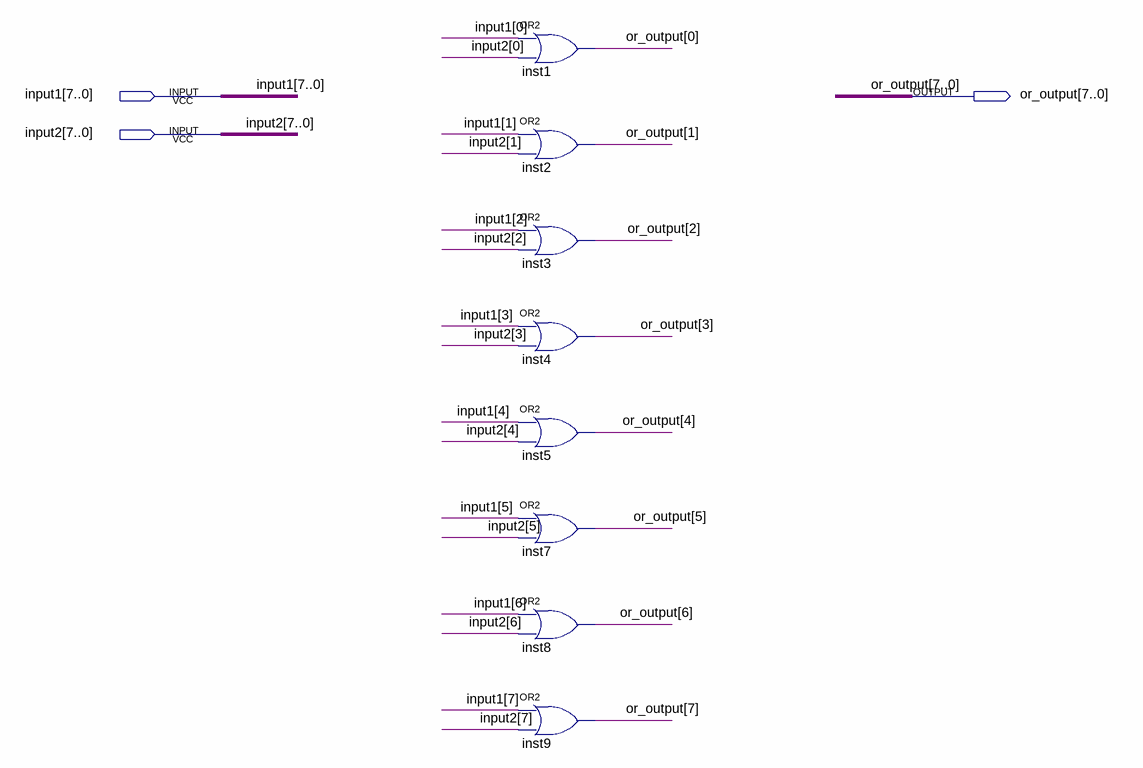
[diagram p0: schematic sheet]
// Quartus schematic OR_8bit.bdf as structural Verilog: 8 symbols, 3 pins
module OR_8bit (
  input  [7:0] input1,
  input  [7:0] input2,
  output [7:0] or_output
);

  or inst1 (or_output[0], input1[0], input2[0]);
  or inst2 (or_output[1], input1[1], input2[1]);
  or inst3 (or_output[2], input1[2], input2[2]);
  or inst4 (or_output[3], input1[3], input2[3]);
  or inst5 (or_output[4], input1[4], input2[4]);
  or inst7 (or_output[5], input1[5], input2[5]);
  or inst8 (or_output[6], input1[6], input2[6]);
  or inst9 (or_output[7], input1[7], input2[7]);
endmodule
